# EAGLE design T11-MIDIThereminCPU (EAGLE 7.7.0)
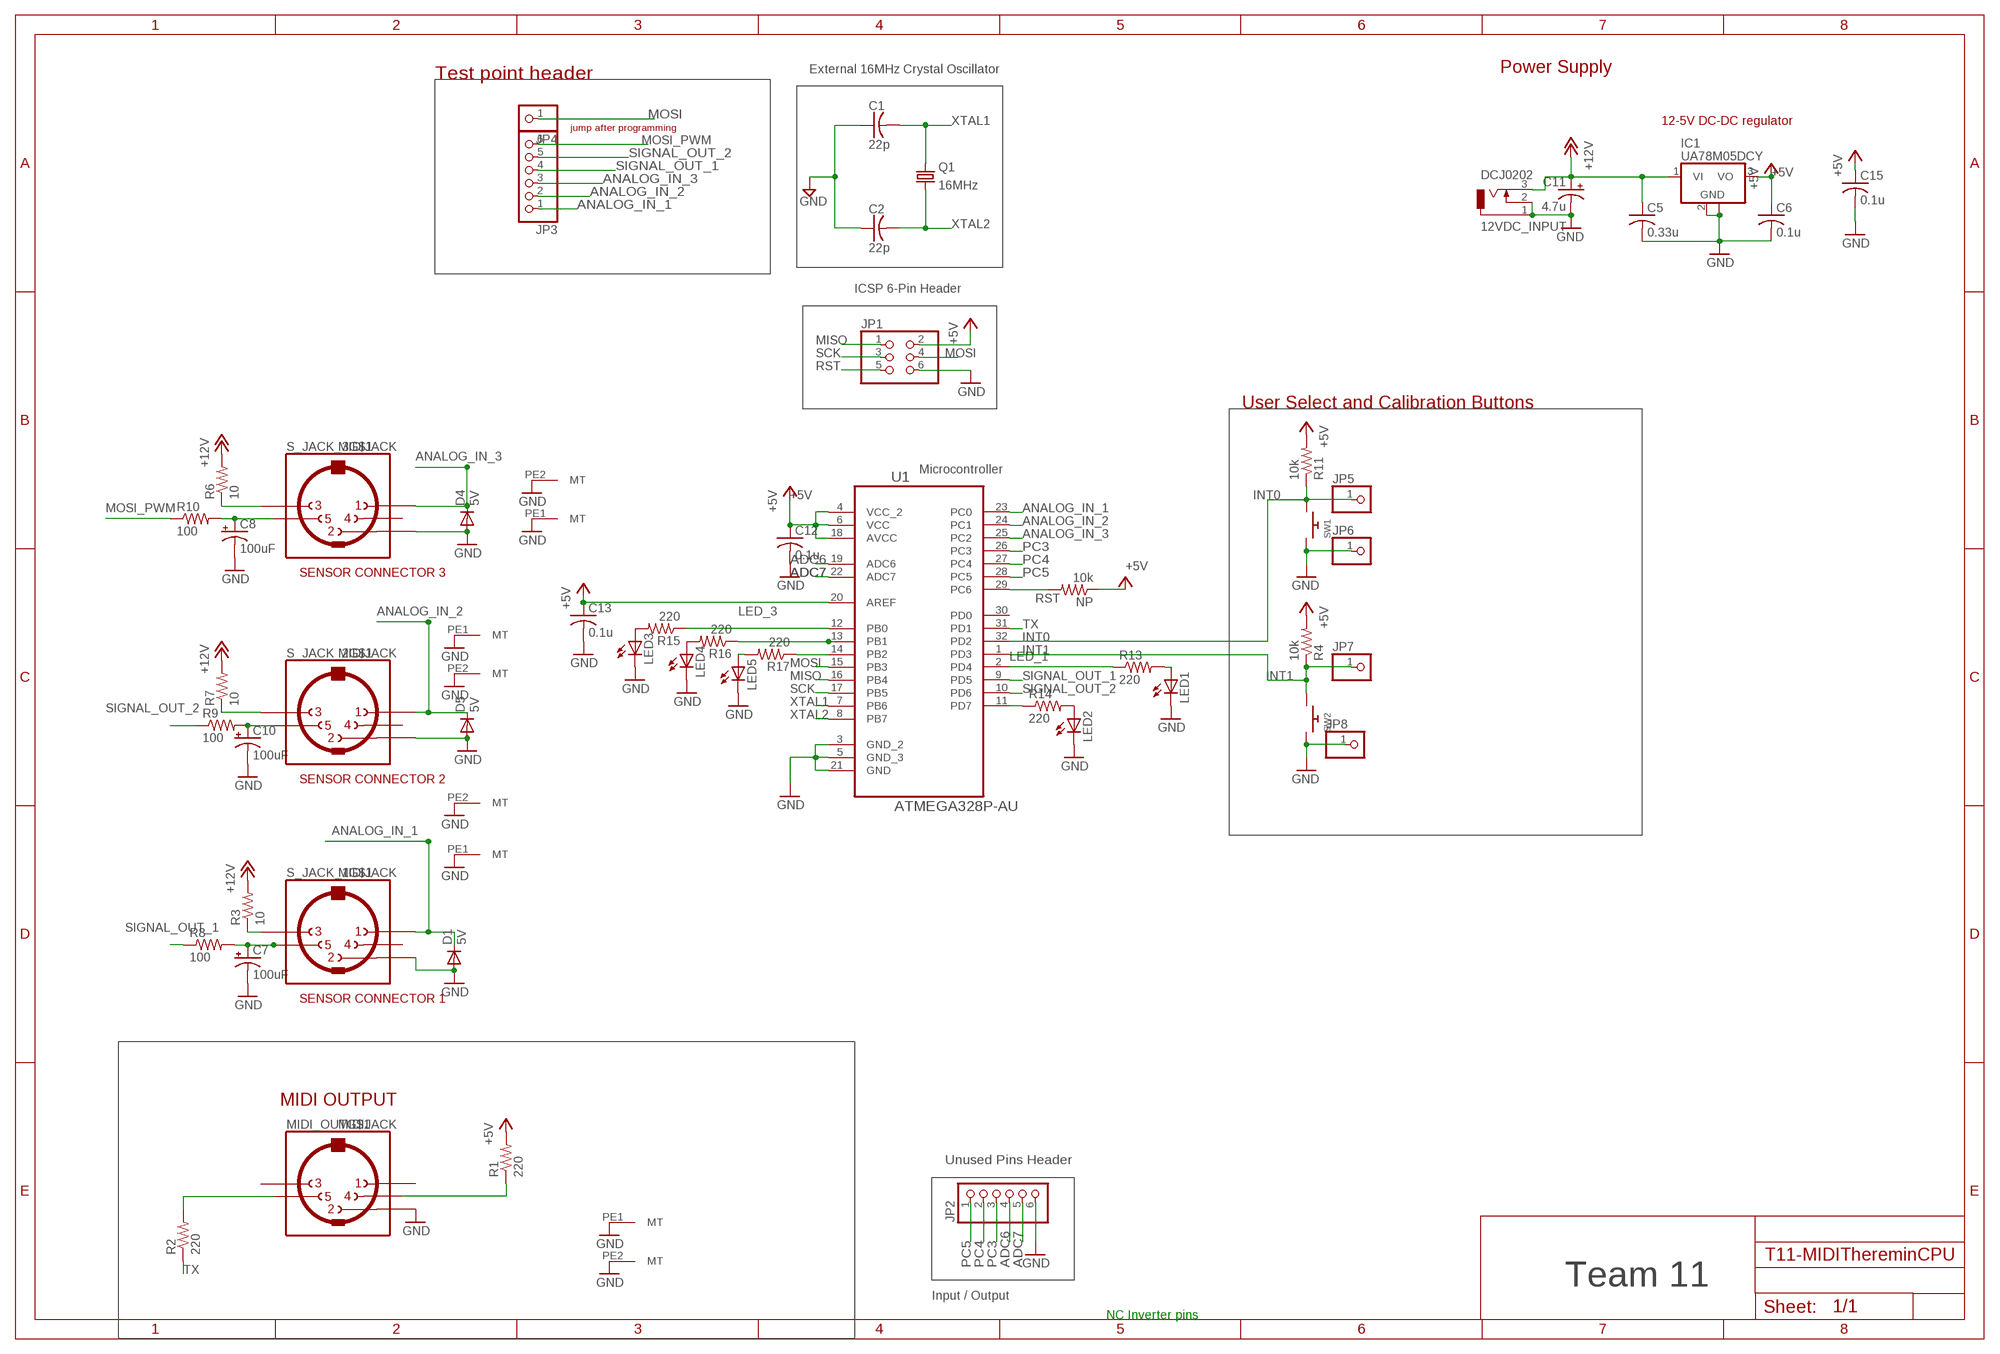
[diagram p0: schematic, sheet 1]

## Parts
12VDC_INPUT  DCJ0202  [DCJ0202]
C1  22p  C-USC0805  [C0805]
C2  22p  C-USC0805  [C0805]
C5  0.33u  C-USC0805  [C0805]
C6  0.1u  C-USC0805  [C0805]
C7  100uF  CPOL-USE3.5-8  [E3,5-8]
C8  100uF  CPOL-USE3.5-8  [E3,5-8]
C10  100uF  CPOL-USE3.5-8  [E3,5-8]
C11  4.7u  CPOL-USE3.5-8  [E3,5-8]
C12  0.1u  C-USC0805  [C0805]
C13  0.1u  C-USC0805  [C0805]
C15  0.1u  C-USC0805  [C0805]
D1  5V  1N4148DO35-7  [DO35-7]
D4  5V  1N4148DO35-7  [DO35-7]
D5  5V  1N4148DO35-7  [DO35-7]
IC1  UA78M05DCY  [SOT223]
JP1  PINHD-2X3  [2X03]
JP2  PINHD-1X6  [1X06]
JP3  PINHD-1X6  [1X06]
JP4  PINHD-1X1  [1X01]
JP5  PINHD-1X1  [1X01]
JP6  PINHD-1X1  [1X01]
JP7  PINHD-1X1  [1X01]
JP8  PINHD-1X1  [1X01]
LED1  LED3MM  [LED3MM]
LED2  LED3MM  [LED3MM]
LED3  LED3MM  [LED3MM]
LED4  LED3MM  [LED3MM]
LED5  LED3MM  [LED3MM]
MIDI_OUT  MIDIJACK  [CP-2350]
NP  10k  R-US_R0805  [R0805]
Q1  16MHz  CRYSTALSM49  [SM49]
R1  220  R-US_R0805  [R0805]
R2  220  R-US_M0805  [M0805]
R3  10  R-US_R0805  [R0805]
R4  10k  R-US_R0805  [R0805]
R6  10  R-US_M0805  [M0805]
R7  10  R-US_R0805  [R0805]
R8  100  R-US_R0805  [R0805]
R9  100  R-US_R0805  [R0805]
R10  100  R-US_M0805  [M0805]
R11  10k  R-US_R0805  [R0805]
R13  220  R-US_R0805  [R0805]
R14  220  R-US_R0805  [R0805]
R15  220  R-US_R0805  [R0805]
R16  220  R-US_R0805  [R0805]
R17  220  R-US_R0805  [R0805]
S_JACK_1  MIDIJACK  [CP-2350]
S_JACK_2  MIDIJACK  [CP-2350]
S_JACK_3  MIDIJACK  [CP-2350]
SW1  SWITCH_PUSHBUTTONSOFTTOUCHSMD_SJ  [PUSHBUTTON_SMD_SJ]
SW2  SWITCH_PUSHBUTTONSOFTTOUCHSMD_SJ  [PUSHBUTTON_SMD_SJ]
U1  ATMEGA328P-AU  [QFP80P900X900X120-32N]

## Nets
+5V: C6.1 C12.1 C13.1 C15.1 IC1.3(VO) JP1.2 NP.1 R1.2 R4.2 R11.2 U1.4(VCC_2) U1.6(VCC) U1.18(AVCC) U1.20(AREF)
+12V: 12VDC_INPUT.3 C5.1 C11.+ IC1.1(VI) R3.2 R6.2 R7.2
ADC6: JP2.4 U1.19(ADC6)
ADC7: JP2.5 U1.22(ADC7)
ANALOG_IN_1: D1.C JP3.1 S_JACK_1.1 U1.23(PC0)
ANALOG_IN_2: D5.C JP3.2 S_JACK_2.1 U1.24(PC1)
ANALOG_IN_3: D4.C JP3.3 S_JACK_3.1 U1.25(PC2)
GND: 12VDC_INPUT.1 12VDC_INPUT.2 C1.1 C2.1 C5.2 C6.2 C7.- C8.- C10.- C11.- C12.2 C13.2 C15.2 D1.A D4.A D5.A IC1.2(GND) IC1.4(GND) JP1.6 JP2.6 JP6.1 JP8.1 LED1.K(C) LED2.K(C) LED3.K(C) LED4.K(C) LED5.K(C) MIDI_OUT.2 MIDI_OUT.PE1(MT) MIDI_OUT.PE2(MT) S_JACK_1.2 S_JACK_1.PE1(MT) S_JACK_1.PE2(MT) S_JACK_2.2 S_JACK_2.PE1(MT) S_JACK_2.PE2(MT) S_JACK_3.2 S_JACK_3.PE1(MT) S_JACK_3.PE2(MT) SW1.P$1 SW2.P$1 U1.3(GND_2) U1.5(GND_3) U1.21(GND)
INT0: JP5.1 R11.1 SW1.P$2 U1.32(PD2)
INT1: JP7.1 R4.1 SW2.P$2 U1.1(PD3)
LED_1: R13.1 U1.2(PD4)
LED_2: R14.1 U1.11(PD7)
LED_3: R15.1 U1.12(PB0)
LED_4: R16.1 U1.13(PB1)
LED_5: R17.1 U1.14(PB2)
MISO: JP1.1 U1.16(PB4)
MOSI: JP1.4 JP4.1 U1.15(PB3)
MOSI_PWM: JP3.6 R10.1
N$2: MIDI_OUT.4 R1.1
N$5: C8.+ R10.2 S_JACK_3.5
N$7: LED1.A R13.2
N$8: R6.1 S_JACK_3.3
N$9: LED2.A R14.2
N$10: C10.+ R9.2 S_JACK_2.5
N$12: R3.1 S_JACK_1.3
N$13: MIDI_OUT.5 R2.2
N$15: LED3.A R15.2
N$16: LED4.A R16.2
N$17: LED5.A R17.2
N$20: R7.1 S_JACK_2.3
N$26: C7.+ R8.2 S_JACK_1.5
PC3: JP2.3 U1.26(PC3)
PC4: JP2.2 U1.27(PC4)
PC5: JP2.1 U1.28(PC5)
RST: JP1.5 NP.2 U1.29(PC6)
SCK: JP1.3 U1.17(PB5)
SIGNAL_OUT_1: JP3.4 R8.1 U1.9(PD5)
SIGNAL_OUT_2: JP3.5 R9.1 U1.10(PD6)
TX: R2.1 U1.31(PD1)
XTAL1: C1.2 Q1.2 U1.7(PB6)
XTAL2: C2.2 Q1.1 U1.8(PB7)
Unconnected: MIDI_OUT.1 MIDI_OUT.3 MIDI_OUT.PE(MT) MIDI_OUT.PE@(MT) S_JACK_1.4 S_JACK_1.PE(MT) S_JACK_1.PE@(MT) S_JACK_2.4 S_JACK_2.PE(MT) S_JACK_2.PE@(MT) S_JACK_3.4 S_JACK_3.PE(MT) S_JACK_3.PE@(MT) U1.30(PD0)

## Notes on the sheet
- External 16MHz Crystal Oscillator | Power Supply
- Test point header
- 12-5V DC-DC regulator
- jump after programming
- ICSP 6-Pin Header
- User Select and Calibration Buttons
- Microcontroller
- SENSOR CONNECTOR 3
- SENSOR CONNECTOR 2
- SENSOR CONNECTOR 1
- MIDI OUTPUT
- Unused Pins Header
- Team 11
- Input / Output
- NC Inverter pins

## Library data of the parts
12VDC_INPUT = con-jack:DCJ0202: DC POWER JACK Source: DCJ0202.pdf; OC_FARNELL: unknown; OC_NEWARK: unknown
C1 C2 C5 C6 C12 C13 C15 = adafruit:C-US: CAPACITOR, American symbol
C7 C8 C10 C11 = adafruit:CPOL-US: POLARIZED CAPACITOR, American symbol
D1 D4 D5 = diode:1N4148: DIODE high speed (Philips)
IC1 = linear:UA78M*: POSITIVE-VOLTAGE REGULATORS Source: http://focus.ti.com/lit/ds/symlink/ua78m33.pdf
JP1 = pinhead:PINHD-2X3: PIN HEADER
JP2 JP3 = adafruit:PINHD-1X6: PIN HEADER
JP4-JP8 = pinhead:PINHD-1X1: PIN HEADER
LED1-LED5 = adafruit:LED: LED OSRAM: - CHIPLED LG R971, LG N971, LY N971, LG Q971, LY Q971, LO R971, LY R971 LH N974, LH R974 LS Q976, LO Q976, LY Q976 LO Q996 - Hyper CHIPLED LW Q18S LB Q993, LB Q99A, LB R99A - SideLED LS A670, LO A670, LY A670, LG A670, LP A670 LB A673, LV A673, LT A673, LW A673 LH A674 LY A675 LS A676, LA A676, LO A676, LY A676, LW A676 LS A679, LY A679, LG A679 - Hyper Micro SIDELED® LS Y876, LA Y876, LO Y876, LY Y876 LT Y87S - SmartLED LW L88C, LW L88S LB L89C, LB L89S, LG L890 LS L89K, LO L89K, LY L89K LS L896, LA L896, LO L896, LY L896 - TOPLED LS T670, LO T670, LY T670, LG T670, LP T670 LSG T670, LSP T670, LSY T670, LOP T670, LYG T670 LG T671, LOG T671, LSG T671 LB T673, LV T673, LT T673, LW T673 LH T674 LS T676, LA T676, LO T676, LY T676, LB T676, LH T676, LSB T676, LW T676 LB T67C, LV T67C, LT T67C, LS T67K, LO T67K, LY T67K, LW E67C LS E67B, LA E67B, LO E67B, LY E67B, LB E67C, LV E67C, LT E67C LW T67C LS T679, LY T679, LG T679 LS T770, LO T770, LY T770, LG T770, LP T770 LB T773, LV T773, LT T773, LW T773 LH T774 LS E675, LA E675, LY E675, LS T675 LS T776, LA T776, LO T776, LY T776, LB T776 LHGB T686 LT T68C, LB T68C - Hyper Mini TOPLED® LB M676 - Mini TOPLED Santana® LG M470 LS M47K, LO M47K, LY M47K Source: http://www.osram.convergy.de/
MIDI_OUT S_JACK_1-S_JACK_3 = adafruit:MIDIJACK: DIN 5 jack also known as MIDI jack A modification of conn-hirshman:MAB5SH with two options for the grounding 'teeth'
NP R1-R4 R6-R11 R13-R17 = resistor:R-US_: RESISTOR, American symbol
Q1 = crystal:CRYSTAL: CRYSTAL; OC_FARNELL: unknown; OC_NEWARK: unknown
SW1 SW2 = adafruit:SWITCH_PUSHBUTTON: Buttons SOFTTOUCHSMD_SJ - Soft touch temporary push button (Super Junk Akihabara) Compatible with SKPMANE010 [Mouser: 688-SKPMAN] C&K_KSS = Digikey: KSS221GLFS
U1 = Atmel_By_element14_Batch_1-00:ATMEGA328P-AU: 8-bit Microcontroller with In-System Programmable Flash; MPN: ATMEGA328P-AU; OC_FARNELL: 1715486; OC_NEWARK: 14R4631; PACKAGE: TQFP-32; SUPPLIER: Atmel

## Board
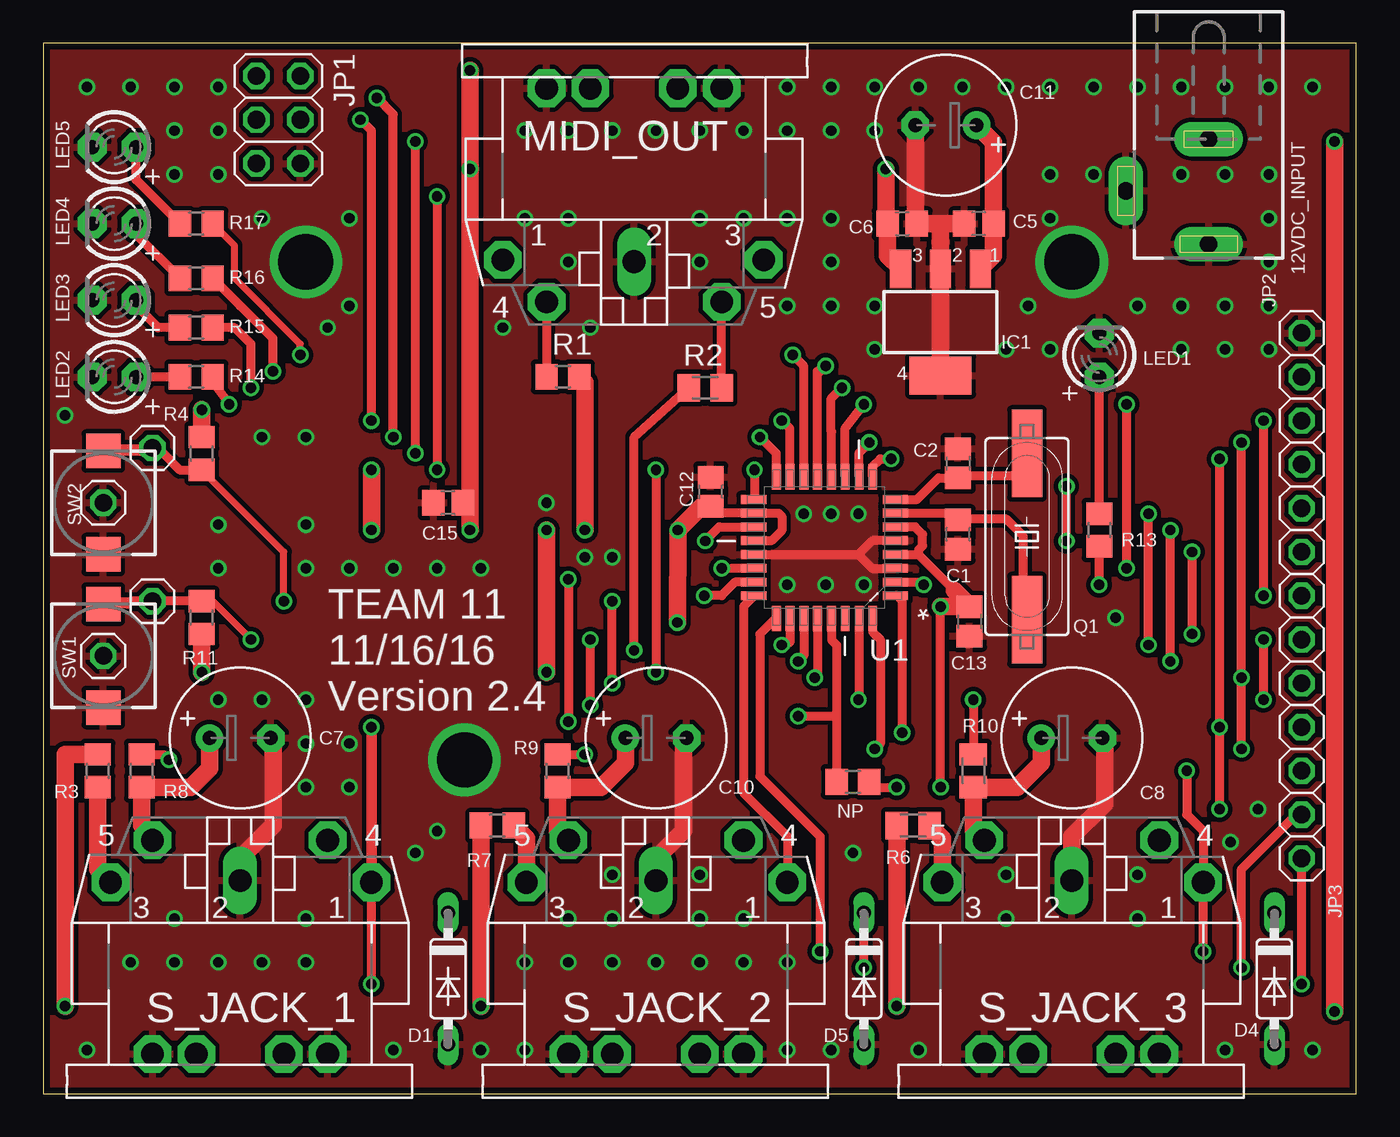
[diagram p1: board, top side]
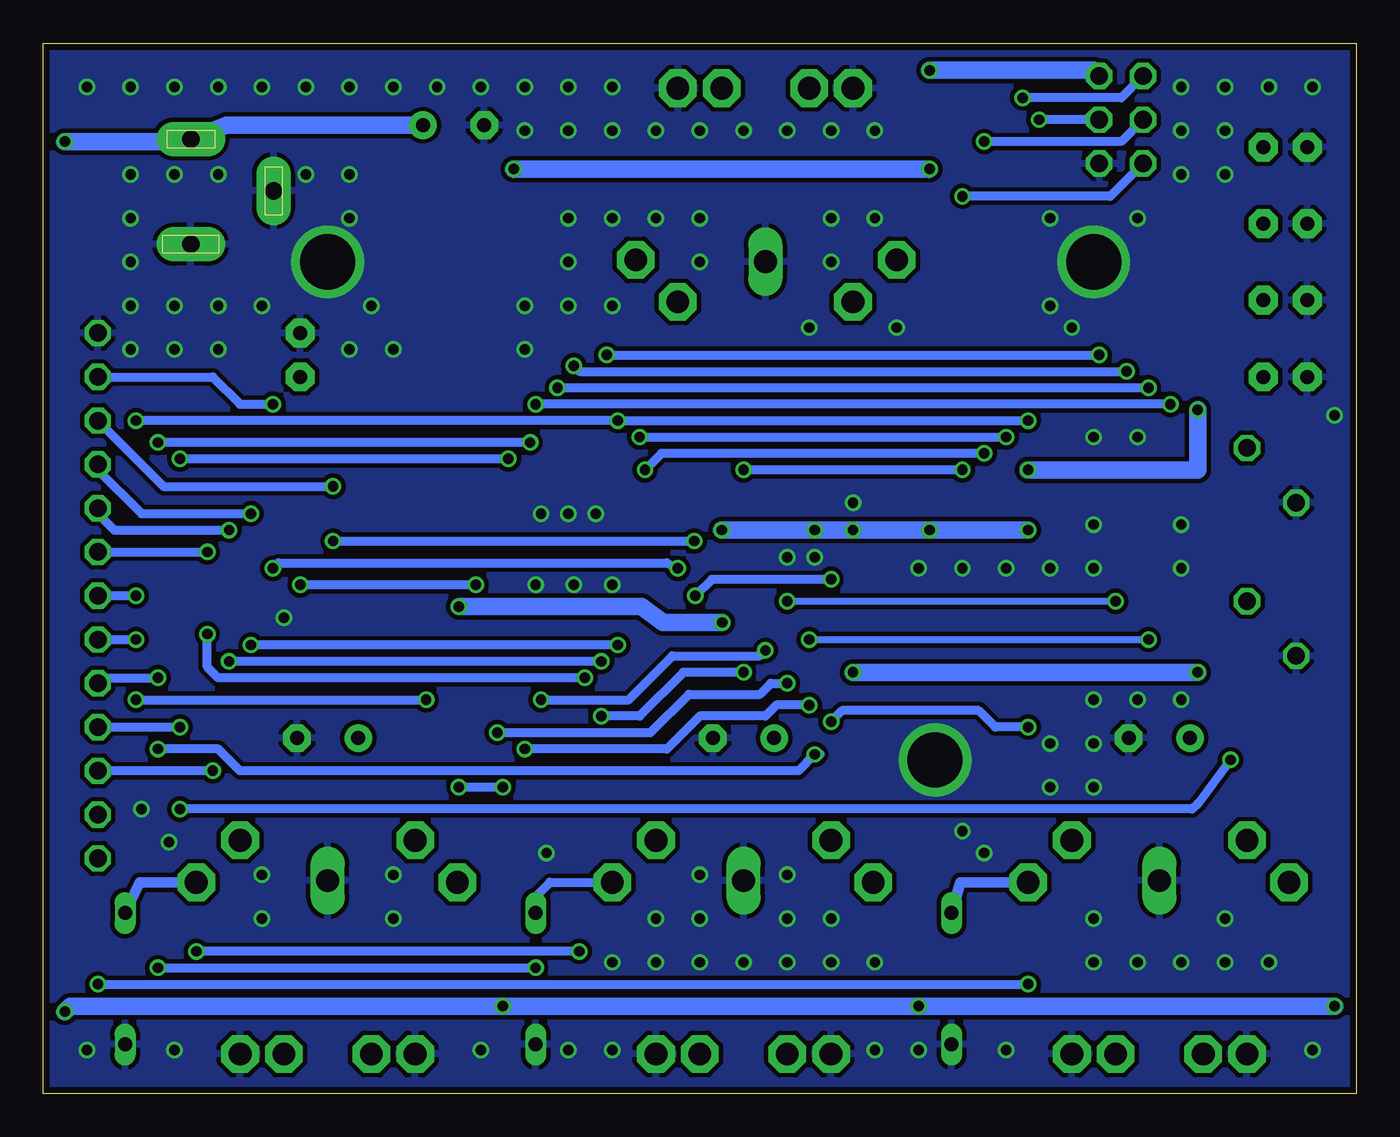
[diagram p2: board, bottom side, seen from below]

Size 76.2 x 60.96 mm. Coordinates in mm from the lower left corner, seen from the top.
Outline: 0,0 76.2,0 76.2,60.96 0,60.96 0,0
Copper layers (1*16): Top 0.0356mm / dielectric 1.5011mm / Bottom 0.0356mm
Design rules "OSH-Park-2-layer *": minimum track width 6mil, minimum drill 13mil, track to track 6mil, track to pad 6mil, pad to pad 6mil, via to via 6mil, smd to smd 6mil, copper to edge 15mil, drill to drill 6mil, minimum pad ring 7mil, minimum via ring 7mil, stop-mask expansion 3mil, vias tented up to drill 25mil, thermal gap 10mil

### Footprints (pad centres in the part's own frame; a part is rotated, then mirrored left to right if it is on the bottom)
DCJ0202 = drill 1 pad 2 long: 1 0,3.1; 2 4.8,0; 3 0,-3
C0805 = smd 1.3 x 1.5: 1 -0.85,0; 2 0.85,0
E3,5-8 = drill 0.813 pad 1.6: + -1.778,0 | drill 0.813 pad 1.6 octagon: - 1.778,0
DO35-7 = drill 0.813 long: A 3.81,0; C -3.81,0
SOT223 = smd 1.219 x 2.235: 1 -2.311,-3.099; 2 0,-3.099; 3 2.311,-3.099 | smd 3.6 x 2.2: 4 0,3.099
2X03 = drill 1.016 octagon: 1 -2.54,-1.27; 2 -2.54,1.27; 3 0,-1.27; 4 0,1.27; 5 2.54,-1.27; 6 2.54,1.27
1X06 = drill 1.016 octagon: 1 -6.35,0; 2 -3.81,0; 3 -1.27,0; 4 1.27,0; 5 3.81,0; 6 6.35,0
1X01 = drill 1.016 octagon: 1 0,0
LED3MM = drill 0.813 pad 1.676 octagon: A -1.27,0; K 1.27,0
CP-2350 = drill 1.321 pad 2.184 octagon: 1 7.62,12.58; 3 -7.52,12.58; 4 5.08,15.02; 5 -5.08,15.02; PE -2.54,2.62; PE1 -5.08,2.62; PE2 5.08,2.62; PE@ 2.54,2.62 | drill 1.321 long: 2 0,12.68
R0805 = smd 1.3 x 1.5: 1 -0.95,0; 2 0.95,0
SM49 = smd 5.08 x 1.778: 1 -4.826,0; 2 4.826,0
M0805 = smd 1.3 x 1.6: 1 -0.95,0; 2 0.95,0
PUSHBUTTON_SMD_SJ = smd 2 x 2: P$1 3,0; P$2 -3,0
QFP80P900X900X120-32N = smd 1.473 x 0.508: 1 -4.115,2.794; 2 -4.115,2.007; 3 -4.115,1.194; 4 -4.115,0.406; 5 -4.115,-0.406; 6 -4.115,-1.194; 7 -4.115,-2.007; 8 -4.115,-2.794; 17 4.115,-2.794; 18 4.115,-2.007; 19 4.115,-1.194; 20 4.115,-0.406; 21 4.115,0.406; 22 4.115,1.194; 23 4.115,2.007; 24 4.115,2.794 | smd 0.508 x 1.473: 9 -2.794,-4.115; 10 -2.007,-4.115; 11 -1.194,-4.115; 12 -0.406,-4.115; 13 0.406,-4.115; 14 1.194,-4.115; 15 2.007,-4.115; 16 2.794,-4.115; 25 2.794,4.115; 26 2.007,4.115; 27 1.194,4.115; 28 0.406,4.115; 29 -0.406,4.115; 30 -1.194,4.115; 31 -2.007,4.115; 32 -2.794,4.115

### Placement (x,y rotation side)
12VDC_INPUT  67.63,52.39 180 top
C1  53.09,32.45 90 top
C2  53.09,36.58 270 top
C5  54.29,50.48 180 top
C6  49.85,50.48 0 top
C7  11.43,20.64 0 top
C8  59.69,20.64 0 top
C10  35.56,20.64 0 top
C11  52.39,56.2 180 top
C12  38.73,34.92 90 top
C13  53.75,27.4 270 top
C15  23.5,34.29 180 top
D1  23.5,6.67 270 top
D4  71.44,6.67 270 top
D5  47.62,6.67 270 top
IC1  52.07,44.77 180 top
JP1  13.65,56.52 270 top
JP2  73.03,37.78 90 top
JP3  73.03,20 90 top
JP4  73.03,28.89 0 top
JP5  6.35,28.57 0 top
JP6  3.49,34.29 0 top
JP7  6.35,37.47 0 top
JP8  3.49,25.4 0 top
LED1  61.28,42.86 90 top
LED2  4.13,41.59 180 top
LED3  4.13,46.04 180 top
LED4  4.13,50.48 180 top
LED5  4.13,54.93 180 top
MIDI_OUT  34.29,60.96 180 top
NP  46.99,18.1 180 top
Q1  57.09,32.32 270 top
R1  30.16,41.59 0 top
R2  38.42,40.96 0 top
R3  3.17,18.73 90 top
R4  9.21,37.15 90 top
R6  50.48,15.56 180 top
R7  26.35,15.56 180 top
R8  5.71,18.73 270 top
R9  29.84,18.73 270 top
R10  53.98,18.73 270 top
R11  9.21,27.62 270 top
R13  61.28,32.7 90 top
R14  8.89,41.59 180 top
R15  8.89,44.45 180 top
R16  8.89,47.31 180 top
R17  8.89,50.48 180 top
S_JACK_1  11.43,-0.32 0 top
S_JACK_2  35.56,-0.32 0 top
S_JACK_3  59.69,-0.32 0 top
SW1  3.49,25.4 270 top
SW2  3.49,34.29 270 top
U1  45.34,31.69 180 top

### Tracks (layer width: path | path; a pad name or v marks a point on that pad's centre or on a via)
+5V  (via drill 0.6)
  Top 0.508: C12.1 39.12,33.69 U1.18 41.07,33.69 42.67,33.69 42.86,33.5 42.86,32.68 42.28,32.1 41.32,32.1 41.31,32.09 U1.20 | U1.4 50.8,31.27 | U1.6 50.59,32.88 51.02,32.45 51.02,31.78 50.8,31.56 50.8,31.27 | 50.8,31.27 52.87,29.2 C13.1 | NP.1 48.26,17.78 v49.53,17.78 | v52.07,17.78 v52.07,28.26
  Top 1.016: R11.2 v9.21,24.45 | IC1.3 49,48.63 C6.1 48.9,50.59 v48.9,53.66 | C15.1 24.77,34.29 | R1.2 31.43,41.27 v31.43,32.7 | v29.21,24.45 v29.21,32.7 | 24.77,34.29 v24.77,53.66 v24.77,59.37 | 24.77,34.29 v24.77,32.7 | R4.2 v9.21,39.69 | v19.05,36.2 v19.05,32.7 | 52.87,29.2 53.66,28.42 53.66,28.26 v52.07,28.26 | v36.8,27.34 v36.83,32.7 38.2,34.08 C12.1
  Bottom 0.508: v49.53,17.78 v52.07,17.78
  Bottom 1.016: v36.83,32.7 v31.43,32.7 v29.21,32.7 v24.77,32.7 v19.05,32.7 | v9.21,24.45 v29.21,24.45 | v48.9,53.66 v24.77,53.66 | v24.77,59.37 15.24,59.37 JP1.2 | v9.21,39.69 9.21,36.2 v19.05,36.2 | v52.07,28.26 41.47,28.26 40.23,27.34 v36.8,27.34
+12V  (via drill 0.6)
  Top 1.016: IC1.1 55.14,48.63 C5.1 55.14,55.22 C11.+ | v74.93,55.24 v74.93,4.76 | R6.2 v49.53,5.08 | R7.2 v25.4,5.08 | R3.2 1.27,19.68 v1.27,5.08
  Bottom 1.016: v74.93,4.76 74.61,5.08 v49.53,5.08 v25.4,5.08 v1.27,5.08 | v74.93,55.24 66.5,55.24 12VDC_INPUT.3 65.55,56.2 C11.+
ADC6  (via drill 0.6)
  Top 0.508: U1.19 39.23,32.88 v38.42,32.07 | v59.37,32.07 v59.37,35.24
  Bottom 0.508: JP2.4 69.22,35.24 v59.37,35.24 | v59.37,32.07 v38.42,32.07
ADC7  (via drill 0.6)
  Top 0.508: v62.87,40.01 v62.87,30.48 | v39.37,30.48 39.99,30.49 U1.22
  Bottom 0.508: JP2.5 66.36,41.59 64.77,40.01 v62.87,40.01 | v62.87,30.48 62.55,30.8 | 62.55,30.8 40.01,30.8 | 40.01,30.8 v39.37,30.48 | 62.55,30.8 40.01,30.8
ANALOG_IN_1  (via drill 0.6)
  Top 0.508: v30.48,29.84 v30.48,21.59 | v19.05,6.35 S_JACK_1.1 | U1.23 40.16,29.68 39.37,28.89 v38.35,28.89 | v73.03,6.35 JP3.1
  Top 0.61: S_JACK_1.1 v19.05,21.27
  Bottom 0.508: v73.03,6.35 v19.05,6.35 | v30.48,29.84 37.4,29.84 v38.35,28.89 | v19.05,21.27 20.95,21.27 21.91,22.23 29.84,22.23 v30.48,21.59
  Bottom 0.61: S_JACK_1.1 22.98,12.26 D1.C
ANALOG_IN_2  (via drill 0.6)
  Top 0.508: U1.24 41.22,28.84 40.64,28.26 40.64,17.46 43.18,14.92 S_JACK_2.1 | v47.62,7.3 D5.C | v69.53,7.3 69.53,13.02 73.03,16.51 JP3.2
  Bottom 0.508: v69.53,7.3 v47.62,7.3 | D5.C 47.62,11.43 46.79,12.26 S_JACK_2.1
ANALOG_IN_3  (via drill 0.6)
  Top 0.508: v45.09,8.26 45.09,14.92 41.59,18.41 41.59,26.67 42.55,27.62 U1.25 | v66.36,18.73 66.36,16.19 67.31,15.24 S_JACK_3.1 v67.31,8.26
  Bottom 0.508: v45.09,8.26 v67.31,8.26 | v66.36,18.73 JP3.3
  Bottom 0.61: S_JACK_3.1 70.61,12.26 D4.C
GND  (via drill 0.6, 3.2)
  Top 0.508: 49.47,30.48 U1.3 48.11,30.48 47.31,31.28 | U1.21 47.31,31.28 | U1.5 48.12,32.09 47.31,31.28
  Top 1.016: S_JACK_3.2 59.69,14.92 61.59,16.83 61.59,20.51 C8.- | S_JACK_2.2 35.56,13.65 37.15,15.24 37.15,20.45 C10.- | S_JACK_1.2 11.43,13.65 13.34,15.56 13.34,20.51 C7.- | C11.- 50.61,50.57 C6.2 52.07,50.48 | C5.2 52.07,50.48 | 52.07,50.48 IC1.2 IC1.4 | C13.2 53.66,26.45 53.66,26.35
  Bottom 0.508: 73.03,44.45 JP2.6
  other vias: 62.23,27.62 7.62,58.42 33.02,31.11 59.69,48.26 24.45,19.37 15.24,48.26 7.62,55.88 10.16,58.42 10.16,55.88 10.16,53.34 7.62,53.34 5.08,58.42 2.54,58.42 12.7,50.8 17.78,50.8 17.78,45.72 45.72,58.42 45.72,55.88 43.18,58.42 43.18,55.88 40.64,55.88 48.26,58.42 50.8,58.42 53.34,58.42 55.88,58.42 58.42,58.42 60.96,58.42 63.5,58.42 66.04,58.42 68.58,58.42 71.12,58.42 73.66,58.42 45.72,50.8 45.72,45.72 45.72,48.26 48.26,45.72 48.26,55.88 58.42,53.34 60.96,53.34 66.04,53.34 68.58,53.34 71.12,50.8 71.12,53.34 58.42,50.8 71.12,48.26 71.12,45.72 68.58,45.72 66.04,45.72 63.5,45.72 66.04,43.18 68.58,43.18 71.12,43.18 58.42,43.18 55.88,43.18 48.26,43.18 43.18,45.72 38.1,48.26 30.48,48.26 73.66,2.54 68.58,2.54 50.8,2.54 55.88,10.16 63.5,10.16 63.5,12.7 55.88,12.7 45.72,2.54 43.18,2.54 43.18,7.62 40.64,7.62 40.64,10.16 38.1,10.16 38.1,7.62 35.56,7.62 33.02,7.62 33.02,10.16 30.48,10.16 30.48,7.62 27.94,7.62 27.94,2.54 25.4,2.54 38.1,12.7 33.02,12.7 20.32,2.54 2.54,2.54 5.08,7.62 7.62,7.62 10.16,7.62 12.7,7.62 15.24,7.62 15.24,10.16 7.62,10.16 15.24,17.78 15.24,20.32 12.7,22.86 10.16,22.86 17.78,17.78 17.78,20.32 43.18,29.53 45.4,29.53 47.31,33.66 47.62,29.53 45.72,33.66 44.13,33.66 31.43,31.11 46.99,13.97 22.86,15.24 21.59,13.97 29.21,34.29 57.15,45.72 1.27,39.37 16.51,44.45 26.67,44.45 31.75,44.45 15.24,33.02 25.4,30.48 22.86,30.48 20.32,30.48 17.78,30.48 15.24,30.48 10.16,30.48 10.16,33.02 15.24,38.1 12.7,38.1 15.24,22.86 70.48,16.51 68.9,14.61 38.1,55.88 35.56,55.88 33.02,55.88 30.48,55.88 27.94,55.88 27.94,50.8 30.48,50.8 38.1,50.8 40.64,50.8 43.18,50.8
  pour Bottom (isolate 0.254): 0,60.96 76.2,60.96 76.2,0 0,0
  pour Top (isolate 0.254): 0,60.96 76.2,60.96 76.2,0 0,0
INT0  (via drill 0.6)
  Top 0.406: v12.06,26.35 9.84,28.57 R11.1 | JP5.1 4.45,28.57 4.45,28.4
  Top 0.508: v31.75,22.54 v31.75,26.35 | U1.32 48.13,26.8 48.58,26.35 48.58,20.32 v48.26,20 | R11.1 JP5.1 5.08,28.57 4.91,28.4 4.45,28.4 SW1.P$2
  Bottom 0.406: v31.75,26.35 v12.06,26.35
  Bottom 0.508: v31.75,22.54 33.66,22.54 34.29,21.91 38.1,21.91 40.01,20 v48.26,20
INT1  (via drill 0.6)
  Top 0.406: v13.97,28.57 13.97,31.43 R4.1 | JP7.1 3.49,37.47 SW2.P$2
  Top 0.508: v49.85,20.95 49.85,28.57 49.53,28.89 U1.1 | v33.02,23.81 v33.02,28.57 | SW2.P$2 6.84,37.29 7.94,36.2 R4.1
  Bottom 0.406: v33.02,28.57 v13.97,28.57
  Bottom 0.508: v49.85,20.95 40.96,20.95 38.73,23.18 34.61,23.18 33.97,23.81 v33.02,23.81
LED_1  (via drill 0.6)
  Top 0.508: U1.2 50.97,29.68 v51.09,29.53 | v61.28,29.53 R13.1
  Bottom 0.508: v51.09,29.53 v61.28,29.53
LED_2  (via drill 0.6)
  Top 0.406: U1.11 46.51,35.82
  Top 0.508: v10.79,40.01 9.84,41.28 R14.1 | U1.11 46.53,38.59 v47.62,40.01
  Bottom 0.508: v10.79,40.01 v47.62,40.01
LED_3  (via drill 0.6)
  Top 0.508: U1.12 45.74,38.39 45.72,38.42 45.72,40.32 v46.35,40.96 | v12.06,40.96 12.06,43.5 11.11,44.45 R15.1
  Bottom 0.508: v46.35,40.96 v12.06,40.96
LED_4  (via drill 0.6)
  Top 0.508: 44.93,41.76 v45.4,42.23 44.93,41.91 U1.13 | v13.34,41.91 13.34,43.81 11.43,45.72 R16.1
  Bottom 0.508: v45.4,42.23 45.09,41.91 v13.34,41.91
LED_5  (via drill 0.6)
  Top 0.406: v14.92,42.86 14.92,43.5 11.11,47.31 11.11,49.21 R17.1
  Top 0.508: v43.5,42.86 44.15,42.22 U1.14
  Bottom 0.508: v43.5,42.86 v14.92,42.86
MISO  (via drill 0.6)
  Top 0.508: U1.16 42.55,37.15 v41.59,38.1 | v20.32,38.1 20.32,56.83 v19.37,57.78
  Bottom 0.508: JP1.1 13.65,57.78 v19.37,57.78 | v41.59,38.1 v20.32,38.1
MOSI  (via drill 0.6)
  Top 0.508: U1.15 43.33,38.58 v42.86,39.05 | v19.05,39.05 19.05,55.88 v18.41,56.52 | v70.8,39.05 v70.8,28.89
  Bottom 0.508: JP1.4 v18.41,56.52 | v19.05,39.05 v42.86,39.05 v70.8,39.05 | JP4.1 v70.8,28.89
MOSI_PWM  (via drill 0.6)
  Top 0.508: v70.8,26.35 v70.8,22.86 | v53.98,22.86 R10.1
  Bottom 0.508: JP3.6 v70.8,26.35 | v70.8,22.86 v53.98,22.86
N$2
  Top 0.508: MIDI_OUT.4 29.21,45.3 R1.1
N$5
  Top 1.016: S_JACK_3.5 54.51,14.7 53.98,15.24 R10.2 56.52,17.78 57.91,19.18 C8.+
N$7
  Top 0.508: R13.2 LED1.A
N$8
  Top 1.016: 52.17,12.28 S_JACK_3.3 52.17,14.82 R6.1
N$9
  Top 0.508: R14.2 LED2.A
N$10
  Top 1.016: S_JACK_2.5 30.38,14.7 29.84,15.24 R9.2 32.38,17.78 33.78,19.18 C10.+
N$12
  Top 1.016: S_JACK_1.3 3.91,12.28 3.17,13.02 R3.1
N$13
  Top 0.508: R2.2 39.37,45.3 MIDI_OUT.5
N$15
  Top 0.508: R15.2 6.67,44.45 5.4,45.72 LED3.A
N$16
  Top 0.508: R16.2 5.4,49.85 LED4.A
N$17
  Top 0.508: R17.2 5.4,53.02 LED5.A
N$20
  Top 1.016: R7.1 28.04,14.82 S_JACK_2.3
N$26
  Top 1.016: S_JACK_1.5 6.35,14.92 5.71,15.56 R8.2 8.57,17.78 9.65,18.86 C7.+
PC3  (via drill 0.6)
  Top 0.508: U1.26 43.33,26.19 v42.86,26.04 | v64.14,26.04 v64.14,33.66
  Bottom 0.508: v42.86,26.04 v64.14,26.04 | JP2.3 73.03,36.2 70.48,33.66 v64.14,33.66
PC4  (via drill 0.6)
  Top 0.508: U1.27 44.15,25.41 v43.81,25.08 | v65.41,25.08 v65.41,32.7
  Bottom 0.508: v43.81,25.08 v65.41,25.08 | JP2.2 73.03,33.66 72.07,32.7 v65.41,32.7
PC5  (via drill 0.6)
  Top 0.508: U1.28 44.93,24.3 v44.77,24.13 | v66.67,26.67 v66.67,31.43
  Bottom 0.508: v44.77,24.13 66.04,24.13 66.67,24.77 v66.67,26.67 | JP2.1 v66.67,31.43
RST  (via drill 0.6)
  Top 0.508: v22.86,52.07 v22.86,36.2 | v35.56,36.2 v35.56,24.45 | v43.81,21.91 45.74,21.91 45.75,21.91 46.04,21.91 | U1.29 45.74,26.33 46.04,26.04 46.04,22.54 46.04,21.91 | 46.04,21.91 NP.2
  Bottom 0.508: JP1.5 14.29,52.07 v22.86,52.07 | v22.86,36.2 v35.56,36.2 | v35.56,24.45 39.05,24.45 41.59,21.91 v43.81,21.91
SCK  (via drill 0.6)
  Top 0.508: v21.59,55.24 v21.59,37.15 | v41.27,36.2 41.27,34.53 U1.17
  Bottom 0.508: JP1.3 13.65,55.24 v21.59,55.24 | v21.59,37.15 40.32,37.15 v41.27,36.2
SIGNAL_OUT_1  (via drill 0.6)
  Top 0.508: U1.9 48.13,36.39 48.58,36.83 v49.21,36.83 | R8.1 6.99,19.68 v7.3,19.37 | v68.26,16.51 v68.26,21.27 v68.26,36.83
  Bottom 0.508: v49.21,36.83 v68.26,36.83 | v7.3,19.37 9.21,16.83 9.53,16.51 v68.26,16.51 | JP3.4 v68.26,21.27
SIGNAL_OUT_2  (via drill 0.6)
  Top 0.508: U1.10 47.35,37.19 v47.94,37.78 | R9.1 31.11,19.68 v31.43,19.68 | v69.53,20 v69.53,24.13 v69.53,37.78
  Bottom 0.508: v47.94,37.78 v69.53,37.78 | 31.11,19.68 v31.43,19.68 32.38,18.73 64.77,18.73 66.04,20 v69.53,20 | JP3.5 72.71,24.13 v69.53,24.13
TX  (via drill 0.6)
  Top 0.508: U1.31 47.35,23.53 v47.31,22.86 | v34.29,25.72 34.29,38.1 R2.1
  Bottom 0.508: v47.31,22.86 42.23,22.86 39.69,25.4 34.61,25.4 v34.29,25.72
XTAL1
  Top 0.508: 56.77,27.88 57.15,27.5 57.15,27.3 56.87,27.03 56.87,32.35 55.88,33.34 53.12,33.34 C1.2 53.09,33.53 52.93,33.69 U1.7
  Top 1.016: Q1.2 57.09,27.56 56.77,27.88 56.96,27.88 57.15,27.69
XTAL2
  Top 0.508: 56.62,37.62 Q1.1 57.09,35.94 57.15,35.88 53.24,35.88 C2.2 51.95,35.73 50.7,34.48 U1.8

### Text on the board
tNames: TEAM 11 / 11/16/16 / Version 2.4